# Altium schematic sheet arduino.SchDoc
size 264 x 383 mm
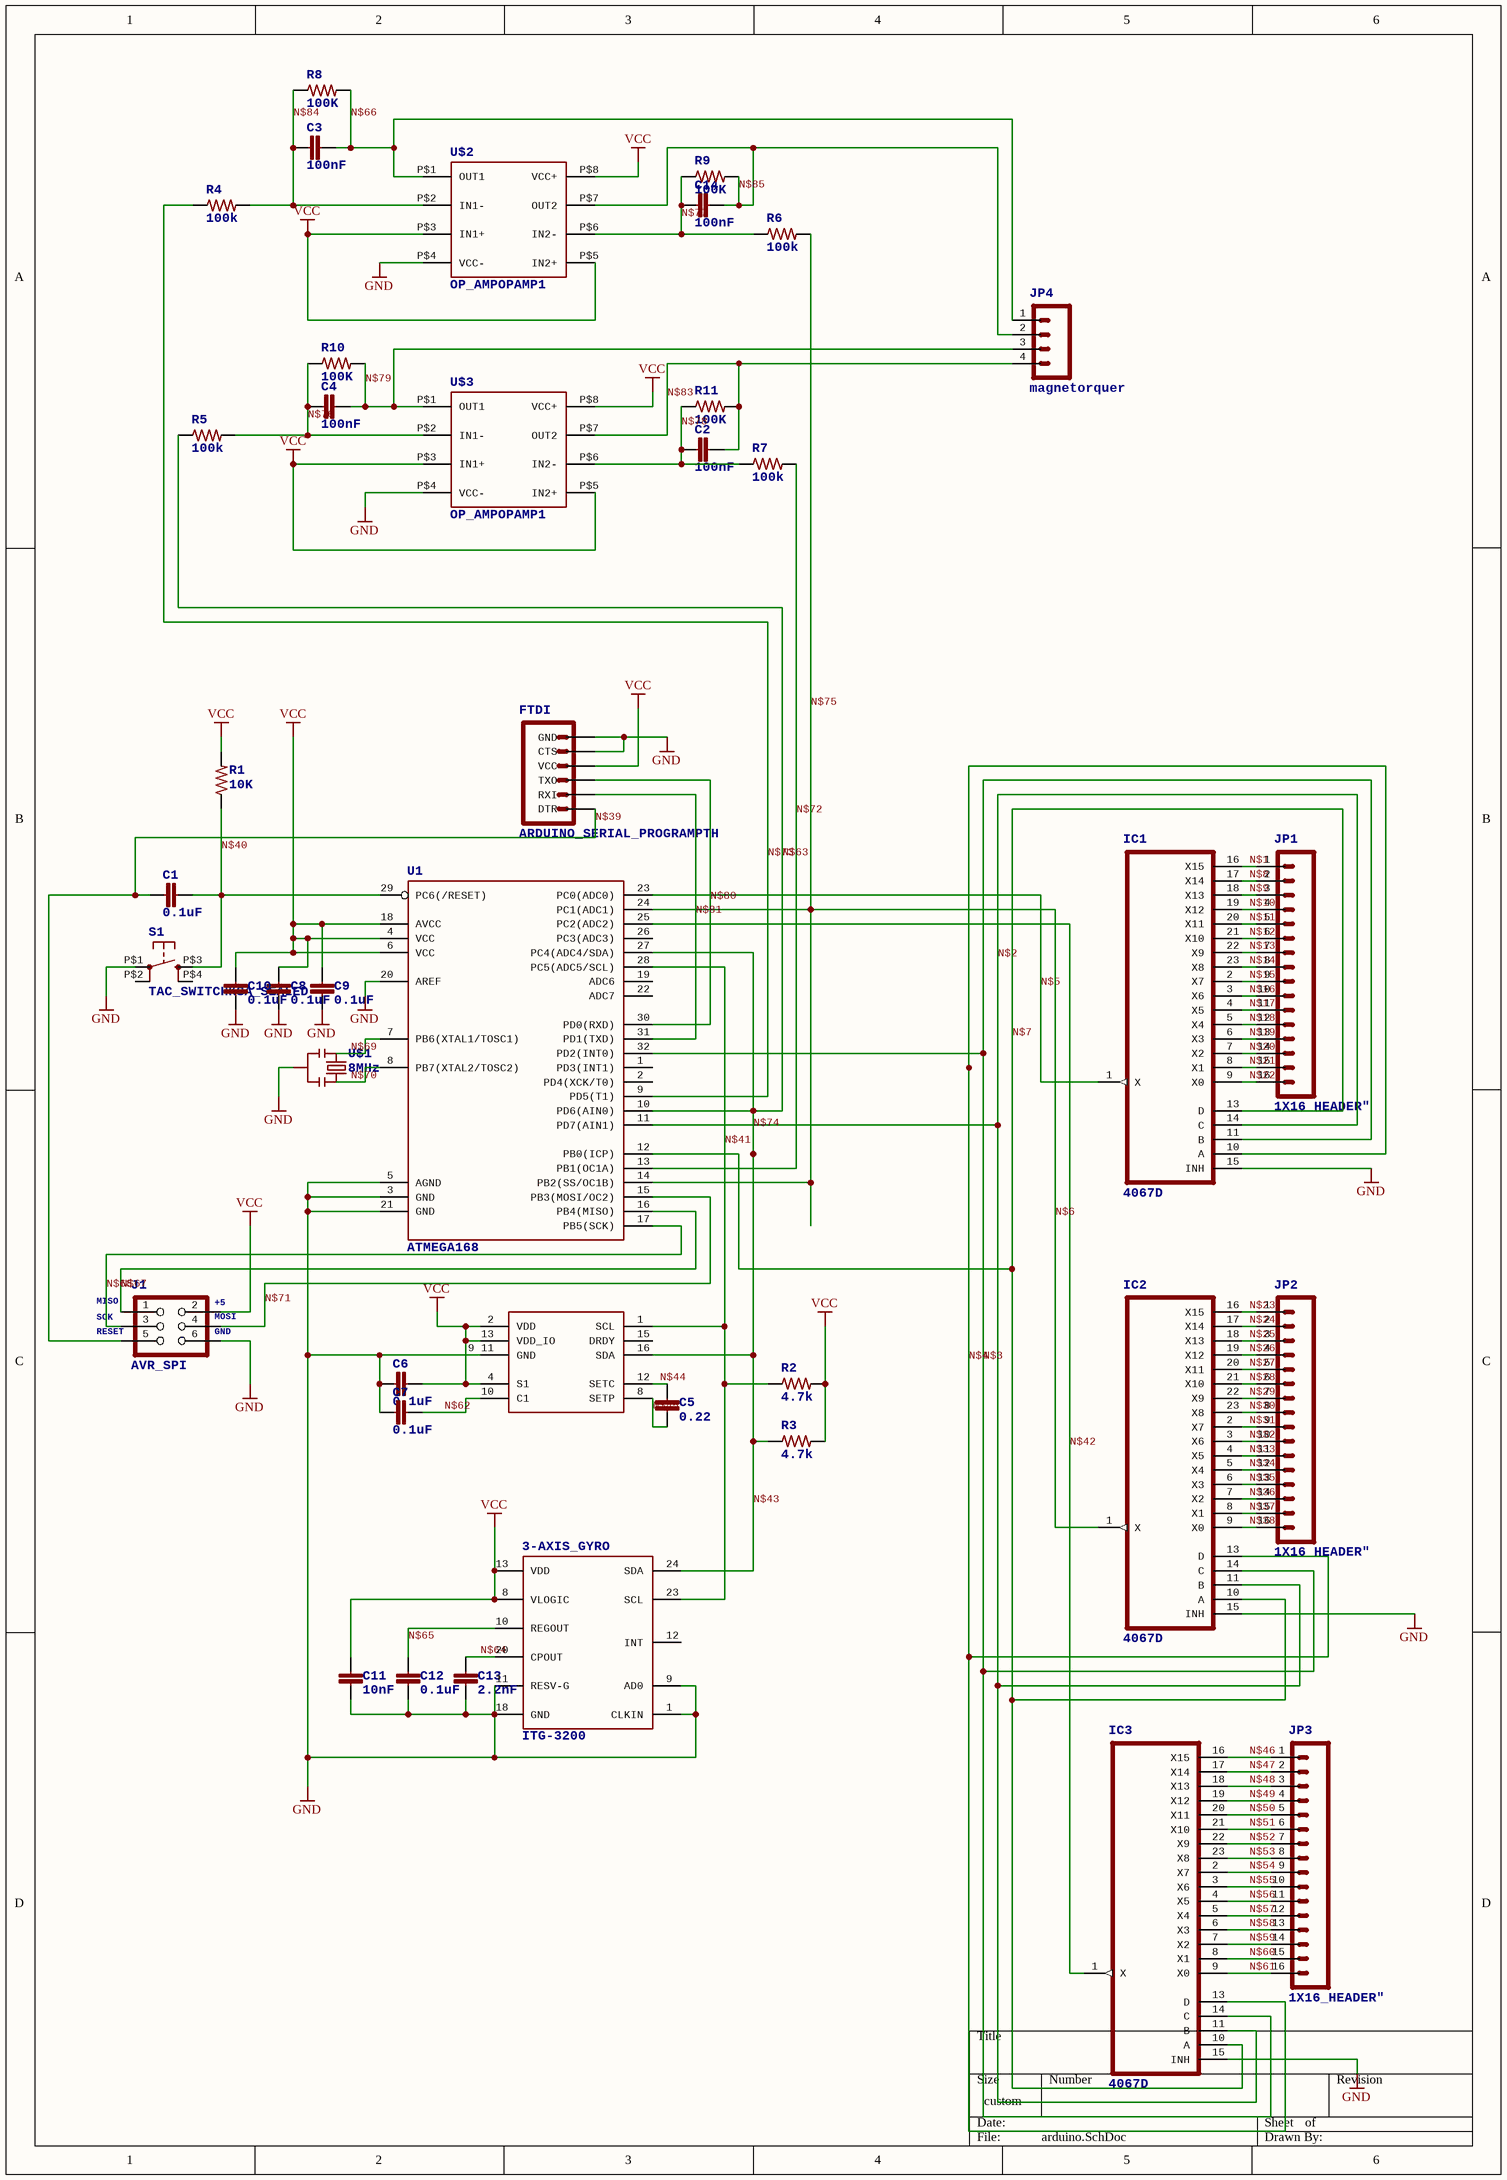
[diagram p0: arduino.SchDoc]

## Parts
3-AXIS_GYRO  ITG-3200  [QFN-24]
3-AXIS_MAG  HMC5883L  [LPCC16]  (value not drawn)
C1  0.1uF  [0603-CAP]
C2  100nF  [0402-CAP]
C3  100nF  [0402-CAP]
C4  100nF  [0402-CAP]
C5  0.22  [0402-CAP]
C6  0.1uF  [0402-CAP]
C7  0.1uF  [0402-CAP]
C8  0.1uF  [0603-CAP]
C9  0.1uF  [0603-CAP]
C10  0.1uF  [0603-CAP]
C11  10nF  [0402-CAP]
C12  0.1uF  [0402-CAP]
C13  2.2nF  [0402-CAP]
C14  100nF  [0402-CAP]
FTDI  ARDUINO_SERIAL_PROGRAMPTH  [1X06]
IC1  4067D  [SO24W]
IC2  4067D  [SO24W]
IC3  4067D  [SO24W]
J1  AVR_SPI  [2X3]
JP1  1X16_HEADER"  [1X16_HEADER]
JP2  1X16_HEADER"  [1X16_HEADER]
JP3  1X16_HEADER"  [1X16_HEADER]
JP4  magnetorquer  [1X04_HEADER]
R1  10K  [0805]
R2  4.7k  [0805]
R3  4.7k  [0805]
R4  100k  [0805]
R5  100k  [0805]
R6  100k  [0805]
R7  100k  [0805]
R8  100K  [0805]
R9  100K  [0805]
R10  100K  [0805]
R11  100K  [0805]
S1  TAC_SWITCHKSA_SEALED  [KSA_SEALED_TAC_SWITCH]
U1  ATMEGA168  [TQFP32-08]
U$1  8MHz  [RESONATOR]
U$2  OP_AMPOPAMP1  [OPAMP]
U$3  OP_AMPOPAMP1  [OPAMP]

## Nets
GND: 3-AXIS_GYRO.1(CLKIN) 3-AXIS_GYRO.9(AD0) 3-AXIS_GYRO.11(RESV-G) 3-AXIS_GYRO.18(GND) 3-AXIS_MAG.9_11(GND) C6.1 C7.1 C8.2 C9.2 C10.2 C11.2 C12.2 C13.2 FTDI.5(CTS) FTDI.6(GND) IC1.15(INH) IC2.15(INH) IC3.15(INH) J1.6 S1.P$1 U1.3(GND) U1.5(AGND) U1.20(AREF) U1.21(GND) U$1.2 U$2.P$4(VCC-) U$3.P$4(VCC-)
VCC: 3-AXIS_GYRO.8(VLOGIC) 3-AXIS_GYRO.13(VDD) 3-AXIS_MAG.2(VDD) 3-AXIS_MAG.4(S1) 3-AXIS_MAG.13(VDD_IO) C6.2 C8.1 C9.1 C10.1 C11.1 FTDI.4(VCC) J1.2 R1.2 R2.2 R3.2 U1.4(VCC) U1.6(VCC) U1.18(AVCC) U$2.P$3(IN1+) U$2.P$5(IN2+) U$2.P$8(VCC+) U$3.P$3(IN1+) U$3.P$5(IN2+) U$3.P$8(VCC+)
N$1: IC1.16(X15) JP1.1
N$2: IC1.14(C) IC2.11(B) IC3.11(B) U1.11(PD7(AIN1))
N$3: IC1.11(B) IC2.14(C) IC3.14(C) U1.32(PD2(INT0))
N$4: IC1.10(A) IC2.13(D) IC3.13(D)
N$5: IC1.1(X) U1.23(PC0(ADC0))
N$6: IC2.1(X) R6.2 U1.14(PB2(SS/OC1B)) U1.24(PC1(ADC1))  [also labelled N$75]
N$7: IC1.13(D) IC2.10(A) IC3.10(A) U1.12(PB0(ICP))
N$8: IC1.17(X14) JP1.2
N$9: IC1.18(X13) JP1.3
N$10: IC1.19(X12) JP1.4
N$11: IC1.20(X11) JP1.5
N$12: IC1.21(X10) JP1.6
N$13: IC1.22(X9) JP1.7
N$14: IC1.23(X8) JP1.8
N$15: IC1.2(X7) JP1.9
N$16: IC1.3(X6) JP1.10
N$17: IC1.4(X5) JP1.11
N$18: IC1.5(X4) JP1.12
N$19: IC1.6(X3) JP1.13
N$20: IC1.7(X2) JP1.14
N$21: IC1.8(X1) JP1.15
N$22: IC1.9(X0) JP1.16
N$23: IC2.16(X15) JP2.1
N$24: IC2.17(X14) JP2.2
N$25: IC2.18(X13) JP2.3
N$26: IC2.19(X12) JP2.4
N$27: IC2.20(X11) JP2.5
N$28: IC2.21(X10) JP2.6
N$29: IC2.22(X9) JP2.7
N$30: IC2.23(X8) JP2.8
N$31: IC2.2(X7) JP2.9
N$32: IC2.3(X6) JP2.10
N$33: IC2.4(X5) JP2.11
N$34: IC2.5(X4) JP2.12
N$35: IC2.6(X3) JP2.13
N$36: IC2.7(X2) JP2.14
N$37: IC2.8(X1) JP2.15
N$38: IC2.9(X0) JP2.16
N$39: C1.1 FTDI.1(DTR) J1.5
N$40: C1.2 R1.1 S1.P$3 U1.29(PC6(/RESET))
N$41: 3-AXIS_GYRO.23(SCL) 3-AXIS_MAG.1(SCL) R2.1 U1.28(PC5(ADC5/SCL))
N$42: IC3.1(X) U1.25(PC2(ADC2))
N$43: 3-AXIS_GYRO.24(SDA) 3-AXIS_MAG.16(SDA) R3.1 R5.1 U1.10(PD6(AIN0)) U1.27(PC4(ADC4/SDA))  [also labelled N$63, N$74]
N$44: 3-AXIS_MAG.12(SETC) C5.1
N$45: 3-AXIS_MAG.8(SETP) C5.2
N$46: IC3.16(X15) JP3.1
N$47: IC3.17(X14) JP3.2
N$48: IC3.18(X13) JP3.3
N$49: IC3.19(X12) JP3.4
N$50: IC3.20(X11) JP3.5
N$51: IC3.21(X10) JP3.6
N$52: IC3.22(X9) JP3.7
N$53: IC3.23(X8) JP3.8
N$54: IC3.2(X7) JP3.9
N$55: IC3.3(X6) JP3.10
N$56: IC3.4(X5) JP3.11
N$57: IC3.5(X4) JP3.12
N$58: IC3.6(X3) JP3.13
N$59: IC3.7(X2) JP3.14
N$60: IC3.8(X1) JP3.15
N$61: IC3.9(X0) JP3.16
N$62: 3-AXIS_MAG.10(C1) C7.2
N$64: 3-AXIS_GYRO.20(CPOUT) C13.1
N$65: 3-AXIS_GYRO.10(REGOUT) C12.1
N$66: C3.2 JP4.1 R8.2 U$2.P$1(OUT1)
N$67: J1.1 U1.16(PB4(MISO))
N$68: J1.3 U1.17(PB5(SCK))
N$69: U1.7(PB6(XTAL1/TOSC1)) U$1.1
N$70: U1.8(PB7(XTAL2/TOSC2)) U$1.3
N$71: J1.4 U1.15(PB3(MOSI/OC2))
N$72: R7.2 U1.13(PB1(OC1A))
N$73: R4.1 U1.9(PD5(T1))
N$76: C4.1 R5.2 R10.1 U$3.P$2(IN1-)
N$77: C14.1 R6.1 R9.1 U$2.P$6(IN2-)
N$78: C2.1 R7.1 R11.1 U$3.P$6(IN2-)
N$79: C4.2 JP4.3 R10.2 U$3.P$1(OUT1)
N$80: FTDI.3(TXO) U1.30(PD0(RXD))
N$81: FTDI.2(RXI) U1.31(PD1(TXD))
N$83: C2.2 JP4.4 R11.2 U$3.P$7(OUT2)
N$84: C3.1 R4.2 R8.1 U$2.P$2(IN1-)
N$85: C14.2 JP4.2 R9.2 U$2.P$7(OUT2)

Not connected (* = marked no-connect by the designer): 3-AXIS_GYRO 12(INT); 3-AXIS_MAG 15(DRDY); S1 P$2(2) P$4(4); U1 1(PD3(INT1)) 2(PD4(XCK/T0)) 19(ADC6) 22(ADC7) 26(PC3(ADC3))

## Library data of the parts
3-AXIS_GYRO = ITG-3200: ITG-3200 3-axis gyro, digital output, qfn24 package
C1 C8-C10 = CAP0603-CAP: CapacitorStandard 0603 ceramic capacitor, and 0.1" leaded capacitor.
C2-C7 C11-C14 = CAP0402-CAP: CapacitorStandard 0603 ceramic capacitor, and 0.1" leaded capacitor.
IC1-IC3 = 4067D: 16-channel ANALOG MULTIPLEXER
J1 = AVR_SPI_PRG_6PTH: AVR ISP 6 PinThis is the reduced ISP connector for AVR programming. Common on Arduino. This footprint will take up less PCB space and can be used with a 10-pin to 6-pin adapter such as SKU: BOB-08508; MOSI: MOSI; RESET: RESET; SCK: SCK; MISO: MISO; +5: +5; GND: GND
JP4 = 1X04_HEADER": Header 4Standard 4-pin 0.1" header. Use with straight break away headers (SKU : PRT-00116), right angle break away headers (PRT-00553), swiss pins (PRT-00743), machine pins (PRT-00117), and female headers (PRT-00115). Molex polarized connector foot print use with SKU : PRT-08231 with associated crimp pins and housings.
R1-R11 = RESISTOR: ResistorBasic schematic elements and footprints for 0603, 1206, and PTH 1/10th watt (small) resistors.
S1 = TAC_SWITCHKSA_SEALED: Momentary SwitchButton commonly used for reset or general input. Spark Fun Electronics SKU : COM-00097
U$1 = RESONATOR": ResonatorSmall SMD resonator. This is the itty bitty 10/20MHz resonators with built in caps. CSTCE10M0G55 and CSTCE20M0V53. Footprint has been reviewed closely but hasn t been tested yet.'